# EAGLE design REV001 (EAGLE 7.7.0)
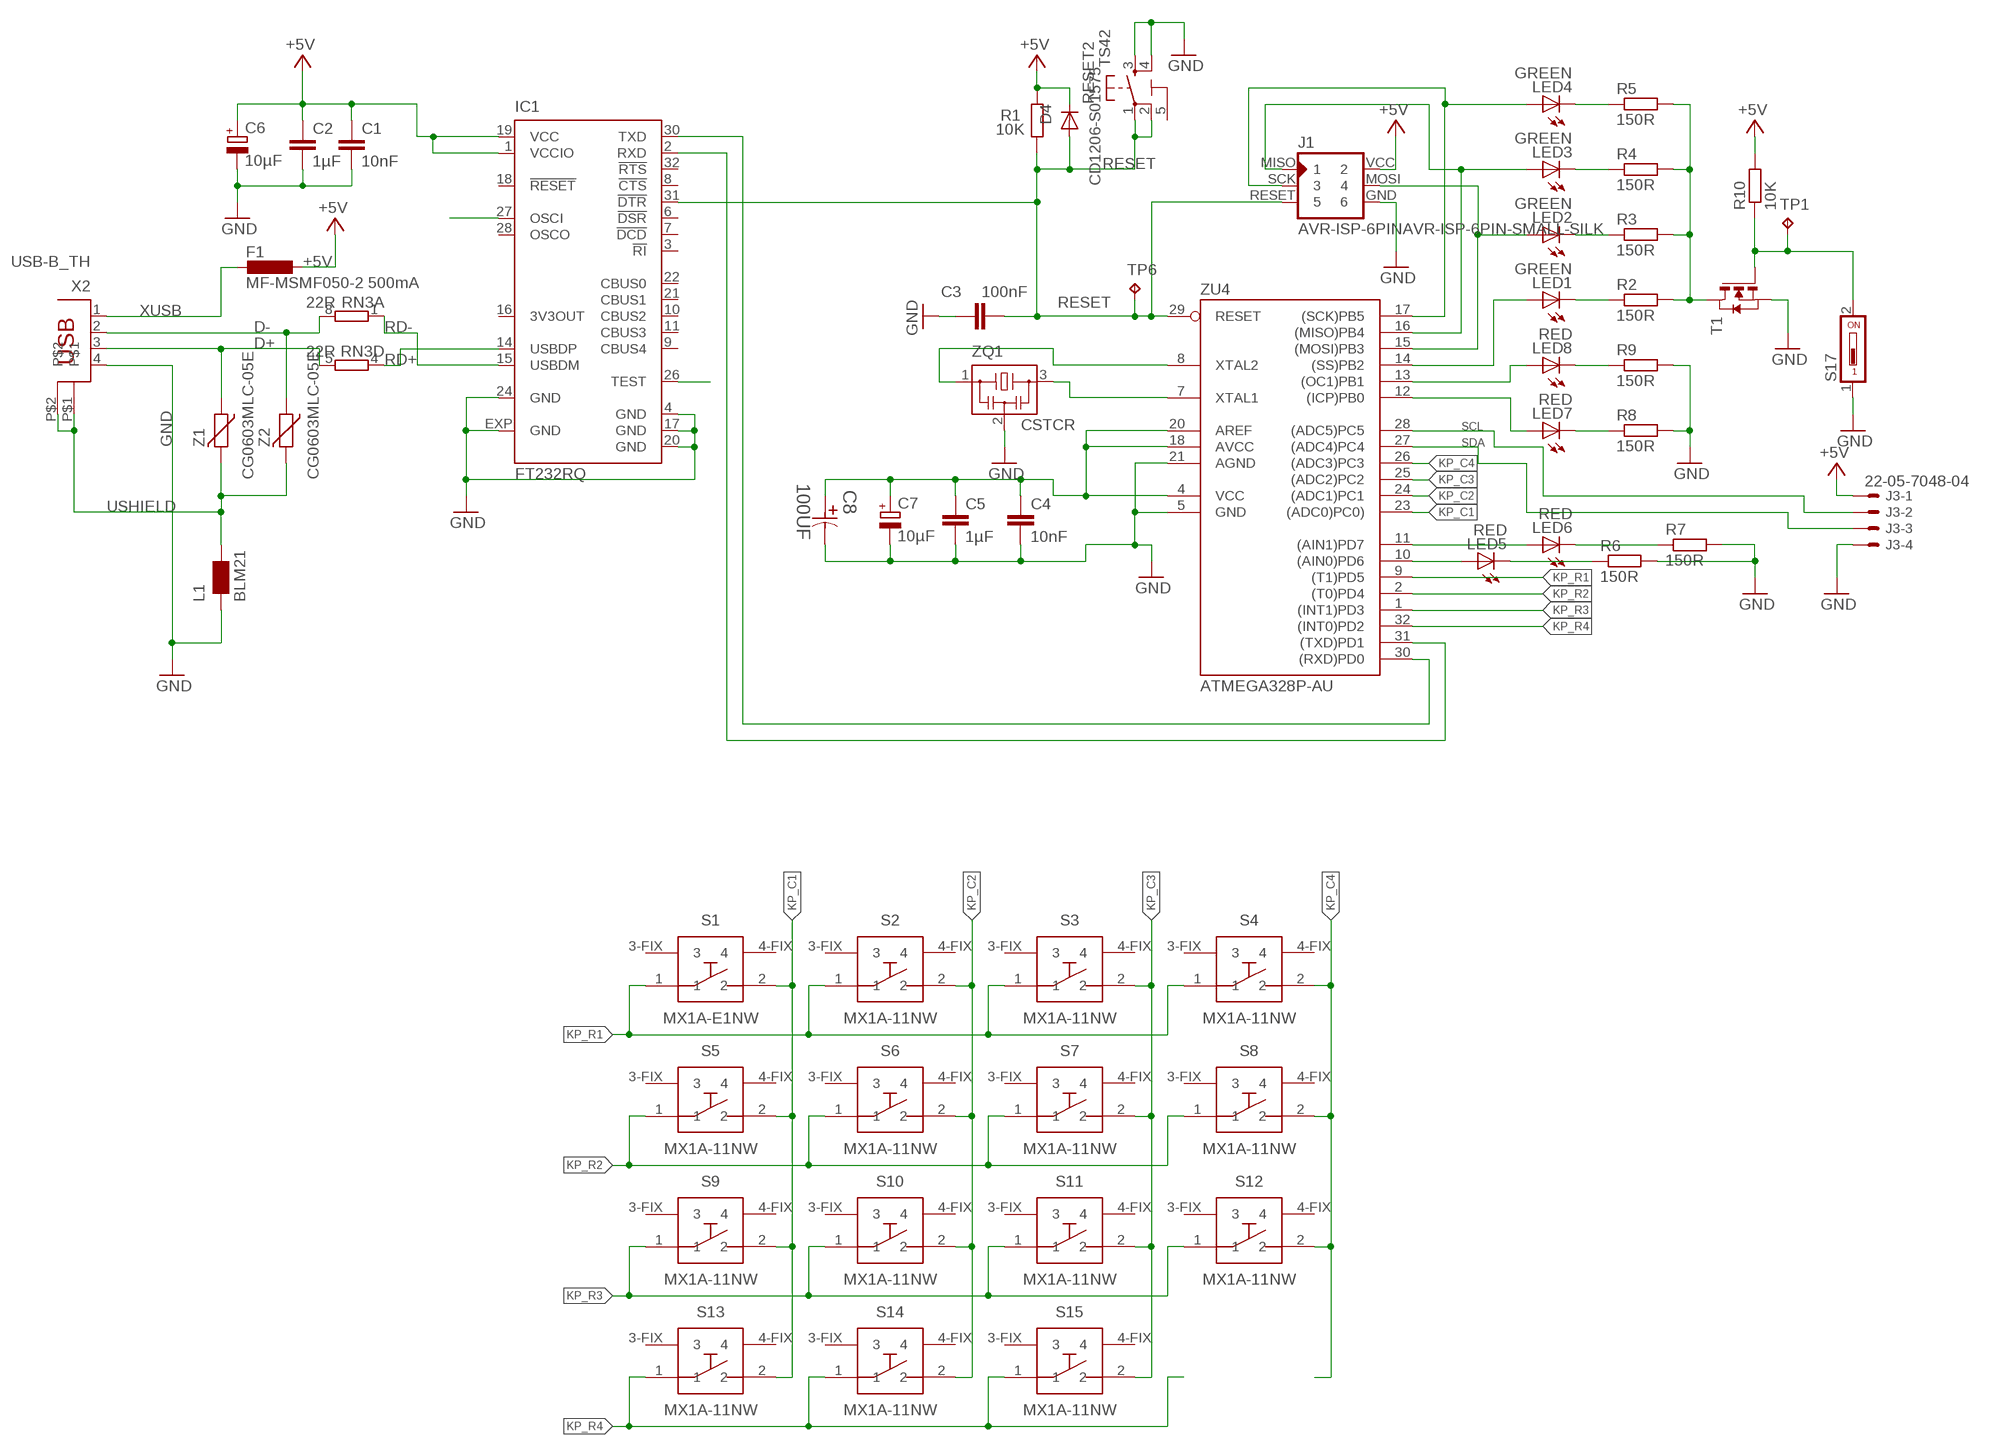
[diagram p0: schematic, sheet 1]

## Parts
C1  10nF  C-EUC0603K  [C0603K]
C2  1µF  C-EUC0603K  [C0603K]
C3  100nF  C-EUC0603  [C0603-ROUND]
C4  10nF  C-EUC0603K  [C0603K]
C5  1µF  C-EUC0603K  [C0603K]
C6  10µF  CPOL-EUSMCB  [SMC_B]
C7  10µF  CPOL-EUSMCB  [SMC_B]
C8  100UF  EEE-FT0J101AR-CASE-B  [CAPAE430X610N]
D4  CD1206-S01575  DIODE-MINIMELF  [MINIMELF]
F1  MF-MSMF050-2 500mA  L-EUL1812  [L1812]
IC1  FT232RQ  [QFN32]
J1  AVR-ISP-6PINAVR-ISP-6PIN-SMALL-SILK  [AVR-ISP-6PIN-SMAILL-SILK]
J3  22-05-7048-04  [7395-04]
L1  BLM21  WE-CBF_0805  [0805]
LED1  GREEN  LEDP-LCC-2  [P-LCC-2]
LED2  GREEN  LEDP-LCC-2  [P-LCC-2]
LED3  GREEN  LEDP-LCC-2  [P-LCC-2]
LED4  GREEN  LEDP-LCC-2  [P-LCC-2]
LED5  RED  LEDP-LCC-2  [P-LCC-2]
LED6  RED  LEDP-LCC-2  [P-LCC-2]
LED7  RED  LEDP-LCC-2  [P-LCC-2]
LED8  RED  LEDP-LCC-2  [P-LCC-2]
R1  10K  R-EU_R0805  [R0805]
R2  150R  R-EU_R0805  [R0805]
R3  150R  R-EU_R0805  [R0805]
R4  150R  R-EU_R0805  [R0805]
R5  150R  R-EU_R0805  [R0805]
R6  150R  R-EU_R0805  [R0805]
R7  150R  R-EU_R0805  [R0805]
R8  150R  R-EU_R0805  [R0805]
R9  150R  R-EU_R0805  [R0805]
R10  10K  R-EU_R0805  [R0805]
RESET2  TS42  [TS42]
RN3  22R  4R-NCAY16  [CAY16]
S1  MX1A-E1NW  MX1A-11NW  [MX1A-11NW_1]
S2  MX1A-11NW  [MX1A-11NW_1]
S3  MX1A-11NW  [MX1A-11NW_1]
S4  MX1A-11NW  [MX1A-11NW_1]
S5  MX1A-11NW  [MX1A-11NW_1]
S6  MX1A-11NW  [MX1A-11NW_1]
S7  MX1A-11NW  [MX1A-11NW_1]
S8  MX1A-11NW  [MX1A-11NW_1]
S9  MX1A-11NW  [MX1A-11NW_1]
S10  MX1A-11NW  [MX1A-11NW_1]
S11  MX1A-11NW  [MX1A-11NW_1]
S12  MX1A-11NW  [MX1A-11NW_1]
S13  MX1A-11NW  [MX1A-11NW_1]
S14  MX1A-11NW  [MX1A-11NW_1]
S15  MX1A-11NW  [MX1A-11NW_1]
S17  DS01  [DS-01]
T1  NMOSSOT23  [SOT-23]
TP1  TPB1,27  [B1,27]
TP6  TPB1,27  [B1,27]
X2  USB-B_TH  PN61729  [PN61729]
Z1  CG0603MLC-05E  VARISTORCN0603  [CT/CN0603]
Z2  CG0603MLC-05E  VARISTORCN0603  [CT/CN0603]
ZQ1  CSTCR  [CSTER12M]
ZU4  ATMEGA328P-AU  [TQFP32-08]

## Nets
+5V: C1.1 C2.1 C4.1 C5.1 C6.+ C7.+ C8.1 D4.C F1.1 IC1.1(VCCIO) IC1.19(VCC) J1.VCC J3.1 R1.2 R10.2 ZU4.4(VCC) ZU4.18(AVCC) ZU4.20(AREF)
D+: RN3.5 X2.3 Z1.1
D-: RN3.8 X2.2 Z2.1
GND: C1.2 C2.2 C3.2 C4.2 C5.2 C6.- C7.- C8.2 IC1.4(GND) IC1.17(GND) IC1.20(GND) IC1.24(GND) IC1.EXP(GND) J1.GND J3.4 L1.1 R6.2 R7.2 R8.2 R9.2 RESET2.3 RESET2.4 S17.1 T1.2(S) X2.4 ZQ1.2 ZU4.5(GND) ZU4.21(AGND)
ISP_ENABLE: R10.1 S17.2 T1.3(G) TP1.TP
KP_C1: S1.2 S5.2 S9.2 S13.2 ZU4.23((ADC0)PC0))
KP_C2: S2.2 S6.2 S10.2 S14.2 ZU4.24((ADC1)PC1)
KP_C3: S3.2 S7.2 S11.2 S15.2 ZU4.25((ADC2)PC2)
KP_C4: S4.2 S8.2 S12.2 ZU4.26((ADC3)PC3)
KP_R1: S1.1 S2.1 S3.1 S4.1 ZU4.9((T1)PD5)
KP_R2: S5.1 S6.1 S7.1 S8.1 ZU4.2((T0)PD4)
KP_R3: S9.1 S10.1 S11.1 S12.1 ZU4.1((INT1)PD3)
KP_R4: S13.1 S14.1 S15.1 ZU4.32((INT0)PD2)
LED1+: LED1.A ZU4.14((SS)PB2)
LED1-: LED1.C R2.1
LED2+: J1.MOSI LED2.A ZU4.15((MOSI)PB3)
LED2-: LED2.C R3.1
LED3+: J1.MISO LED3.A ZU4.16((MISO)PB4)
LED3-: LED3.C R4.1
LED4+: J1.SCK LED4.A ZU4.17((SCK)PB5)
LED4-: LED4.C R5.1
LED5+: LED5.A ZU4.10((AIN0)PD6)
LED5-: LED5.C R6.1
LED6+: LED6.A ZU4.11((AIN1)PD7)
LED6-: LED6.C R7.1
LED7+: LED7.A ZU4.12((ICP)PB0)
LED7-: LED7.C R8.1
LED8+: LED8.A ZU4.13((OC1)PB1)
LED8-: LED8.C R9.1
N$2: IC1.26(TEST)
N$3: IC1.27(OSCI)
N$20 [gnd]: R2.2 R3.2 R4.2 R5.2 T1.1(D)
RD+: IC1.14(USBDP) RN3.4
RD-: IC1.15(USBDM) RN3.1
RESET: C3.1 D4.A IC1.31(!DTR) J1.RESET R1.1 RESET2.1 RESET2.2 TP6.TP ZU4.29(RESET)
RX: IC1.2(RXD) ZU4.31((TXD)PD1)
SCL: J3.2 ZU4.28((ADC5)PC5)
SDA: J3.3 ZU4.27((ADC4)PC4)
TX: IC1.30(TXD) ZU4.30((RXD)PD0)
USHIELD [gnd]: L1.2 X2.P$1 X2.P$2 Z1.2 Z2.2
XTAL1: ZQ1.3 ZU4.7(XTAL1)
XTAL2: ZQ1.1 ZU4.8(XTAL2)
XUSB [usbvcc]: F1.2 X2.1
Unconnected: IC1.3(!RI) IC1.6(!DSR) IC1.7(!DCD) IC1.8(!CTS) IC1.9(CBUS4) IC1.10(CBUS2) IC1.11(CBUS3) IC1.16(3V3OUT) IC1.18(!RESET) IC1.21(CBUS1) IC1.22(CBUS0) IC1.28(OSCO) IC1.32(!RTS) RN3.2 RN3.3 RN3.6 RN3.7 S1.3-FIX S1.4-FIX S2.3-FIX S2.4-FIX S3.3-FIX S3.4-FIX S4.3-FIX S4.4-FIX S5.3-FIX S5.4-FIX S6.3-FIX S6.4-FIX S7.3-FIX S7.4-FIX S8.3-FIX S8.4-FIX S9.3-FIX S9.4-FIX S10.3-FIX S10.4-FIX S11.3-FIX S11.4-FIX S12.3-FIX S12.4-FIX S13.3-FIX S13.4-FIX S14.3-FIX S14.4-FIX S15.3-FIX S15.4-FIX

## Power pins joined to a net without a drawn wire
5-GND: RESET2.5(5-GND)

## Library data of the parts
C1 C2 C4 C5 = rcl:C-EU: CAPACITOR, European symbol
C3 = SmartPrj:C-EU: CAPACITOR, European symbol
C6 C7 = rcl:CPOL-EU: POLARIZED CAPACITOR, European symbol
C8 = Panasonic-EEEFT_EEEH:EEE-: Aluminum Electrolytic Capacitors,Surface Mount Type; MPN: EEE-FT0J101AR; OC_FARNELL: 2065951; OC_NEWARK: 73T9146; PACKAGE: CASE-B; SUPPLIER: PANASONIC; TOLERANCE: ±20 %; VOLTAGERATING: 6.3V
D4 = diode:DIODE-: DIODE
F1 = rcl:L-EU: INDUCTOR, European symbol
IC1 = ftdichip:FT232R: Source: http://www.ftdichip.com/Documents/DataSheets/DS_FT232R_v104.pdf; MPN: FT232RQ; OC_FARNELL: 1146033; OC_NEWARK: 91K9919
J1 = avr-isb:AVR-ISP-6PIN: AVR ISP 6pin 3x2 pin header
J3 = con-molex:22-?-04: CONNECTOR wire to board 2.54 mm (.1 inch) pitch header; OC_FARNELL: unknown; OC_NEWARK: unknown
L1 = wuerth-elektronik:WE-CBF: SMD EMI Suppression Ferrite Beads - excellent anti-EMI properties - low DCR - impedances till 3000 ohms - rated current up to 6 A
LED1-LED8 = adafruit:LED: LED OSRAM: - CHIPLED LG R971, LG N971, LY N971, LG Q971, LY Q971, LO R971, LY R971 LH N974, LH R974 LS Q976, LO Q976, LY Q976 LO Q996 - Hyper CHIPLED LW Q18S LB Q993, LB Q99A, LB R99A - SideLED LS A670, LO A670, LY A670, LG A670, LP A670 LB A673, LV A673, LT A673, LW A673 LH A674 LY A675 LS A676, LA A676, LO A676, LY A676, LW A676 LS A679, LY A679, LG A679 - Hyper Micro SIDELED® LS Y876, LA Y876, LO Y876, LY Y876 LT Y87S - SmartLED LW L88C, LW L88S LB L89C, LB L89S, LG L890 LS L89K, LO L89K, LY L89K LS L896, LA L896, LO L896, LY L896 - TOPLED LS T670, LO T670, LY T670, LG T670, LP T670 LSG T670, LSP T670, LSY T670, LOP T670, LYG T670 LG T671, LOG T671, LSG T671 LB T673, LV T673, LT T673, LW T673 LH T674 LS T676, LA T676, LO T676, LY T676, LB T676, LH T676, LSB T676, LW T676 LB T67C, LV T67C, LT T67C, LS T67K, LO T67K, LY T67K, LW E67C LS E67B, LA E67B, LO E67B, LY E67B, LB E67C, LV E67C, LT E67C LW T67C LS T679, LY T679, LG T679 LS T770, LO T770, LY T770, LG T770, LP T770 LB T773, LV T773, LT T773, LW T773 LH T774 LS E675, LA E675, LY E675, LS T675 LS T776, LA T776, LO T776, LY T776, LB T776 LHGB T686 LT T68C, LB T68C - Hyper Mini TOPLED® LB M676 - Mini TOPLED Santana® LG M470 LS M47K, LO M47K, LY M47K Source: http://www.osram.convergy.de/
R1 = SmartPrj:R-EU_: RESISTOR, European symbol
R2-R10 = rcl:R-EU_: RESISTOR, European symbol
RESET2 = SmartPrj:TS42: TS42 Dongnan Electronics Tact switch VDC 12V - 50mA
RN3 = resistor-dil:4R-N: Array Chip Resistor Source: RS Component / Phycomp; OC_FARNELL: unknown; OC_NEWARK: unknown
S1-S15 = SamacSys_Parts:MX1A-11NW: CHERRY AMERICAS - MX1A-11NW - SWITCH, TACTILE, SPST-NO, 0.01A, THT <https://componentsearchengine.com/Images/1/MX1A-11NW.jpg> Source: Datasheet <http://media.digikey.com/pdf/Data Sheets/Cherry PDFs/MX Series.pdf>; DESCRIPTION: CHERRY AMERICAS - MX1A-11NW - SWITCH, TACTILE, SPST-NO, 0.01A, THT; HEIGHT: mm; MANUFACTURER_NAME: CHERRY AMERICAS; MANUFACTURER_PART_NUMBER: MX1A-11NW
S17 = switch-dil:DS01: DIL/CODE SWITCH; OC_FARNELL: unknown; OC_NEWARK: unknown
T1 = zetex:NMOSSOT23: MOS FET; OC_FARNELL: unknown; OC_NEWARK: unknown
TP1 TP6 = testpad:TP: Test pad
X2 = SmartPrj:PN61729: BERG USB connector
Z1 Z2 = varistor:VARISTOR: VARISTOR
ZQ1 = murata_reso:CSTC?: Resonator CSTCR �- 2.0 x 4.5 mm <http://search.murata.co.jp/Ceramy/CatalogAction.do?sHinnm=?&nbsp&sNHinnm=CSTCR6M00G53-R0&sNhin_key=CSTCR6M00G53-R0&sLang=en&sParam=CSTCR> CSTCE �- 1.3 x 3.2 mm <http://search.murata.co.jp/Ceramy/CatalogAction.do?sHinnm=?&nbsp&sNHinnm=CSTCE8M00G52-R0&sNhin_key=CSTCE8M00G52-R0&sLang=en&sParam=CSTCE>
ZU4 = SmartPrj:ATMEGA328P-: MICROCONTROLLER 4 Kbytes FLASH 128 bytes SRAM 256 bytes EEPROM UART 6-channel 10 bit ADC

## Net classes
1 power: width 0.152 mm, drill 0.61 mm, clearance 0.152 mm
2 gnd: width 0.305 mm, drill 0.559 mm, clearance 0.254 mm
3 usbvcc: width 0.508 mm, drill 0.61 mm, clearance 0.254 mm
4 aref: width 0.406 mm, drill 0.61 mm, clearance 0.254 mm

## Board
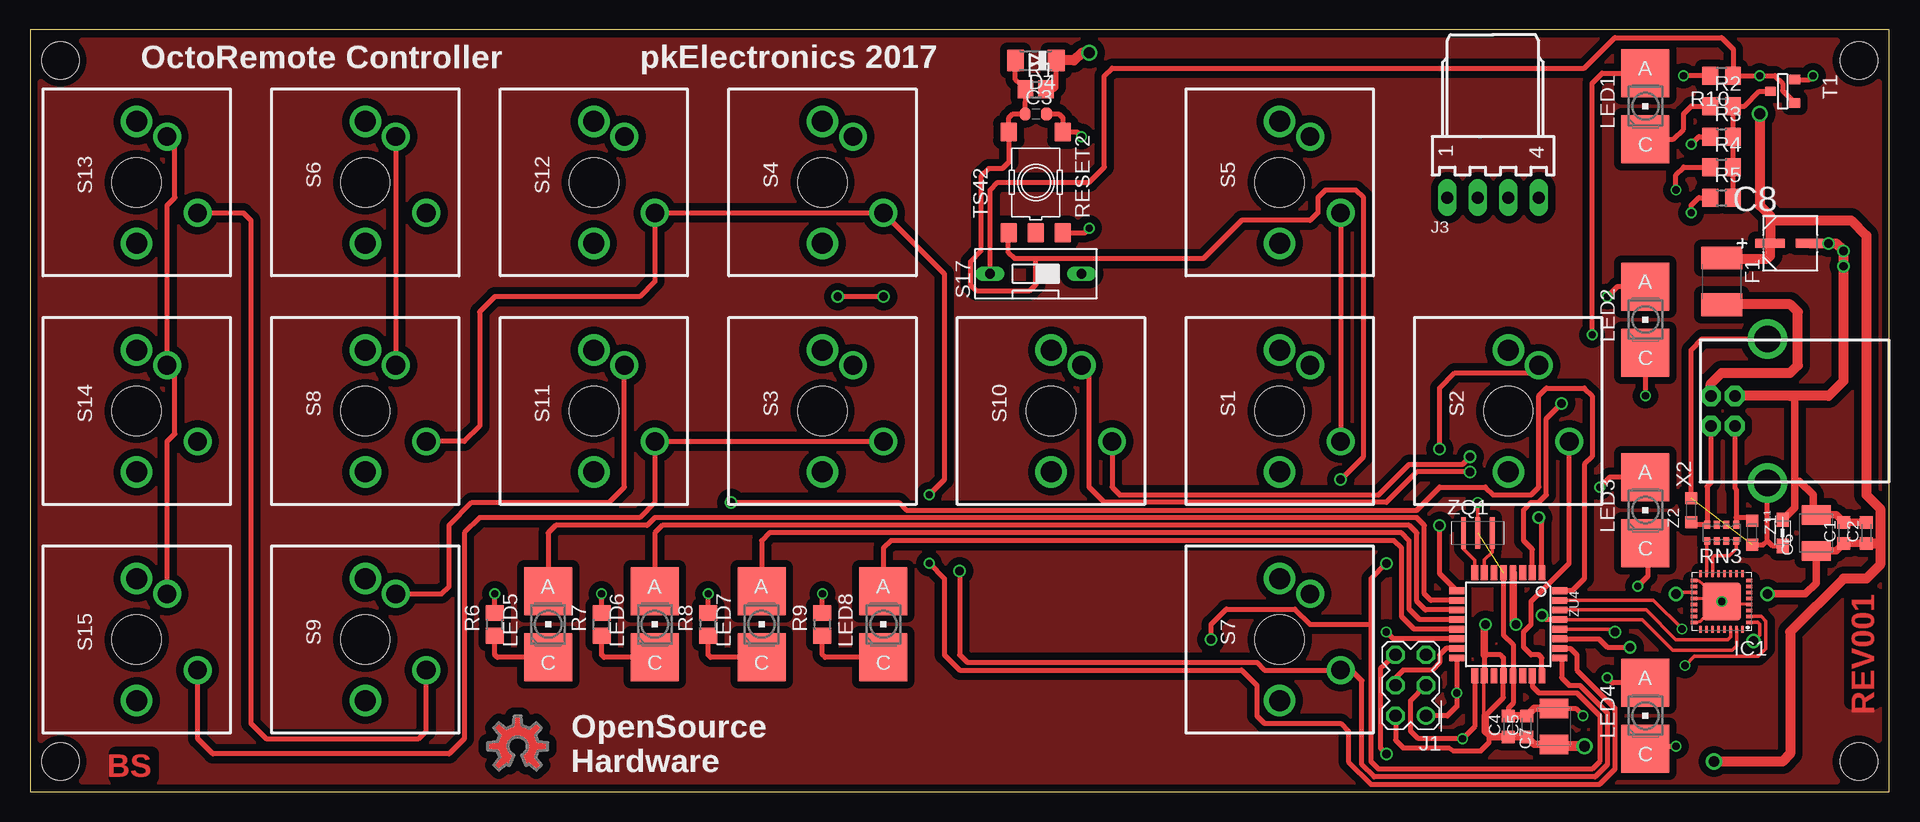
[diagram p1: board, top side]
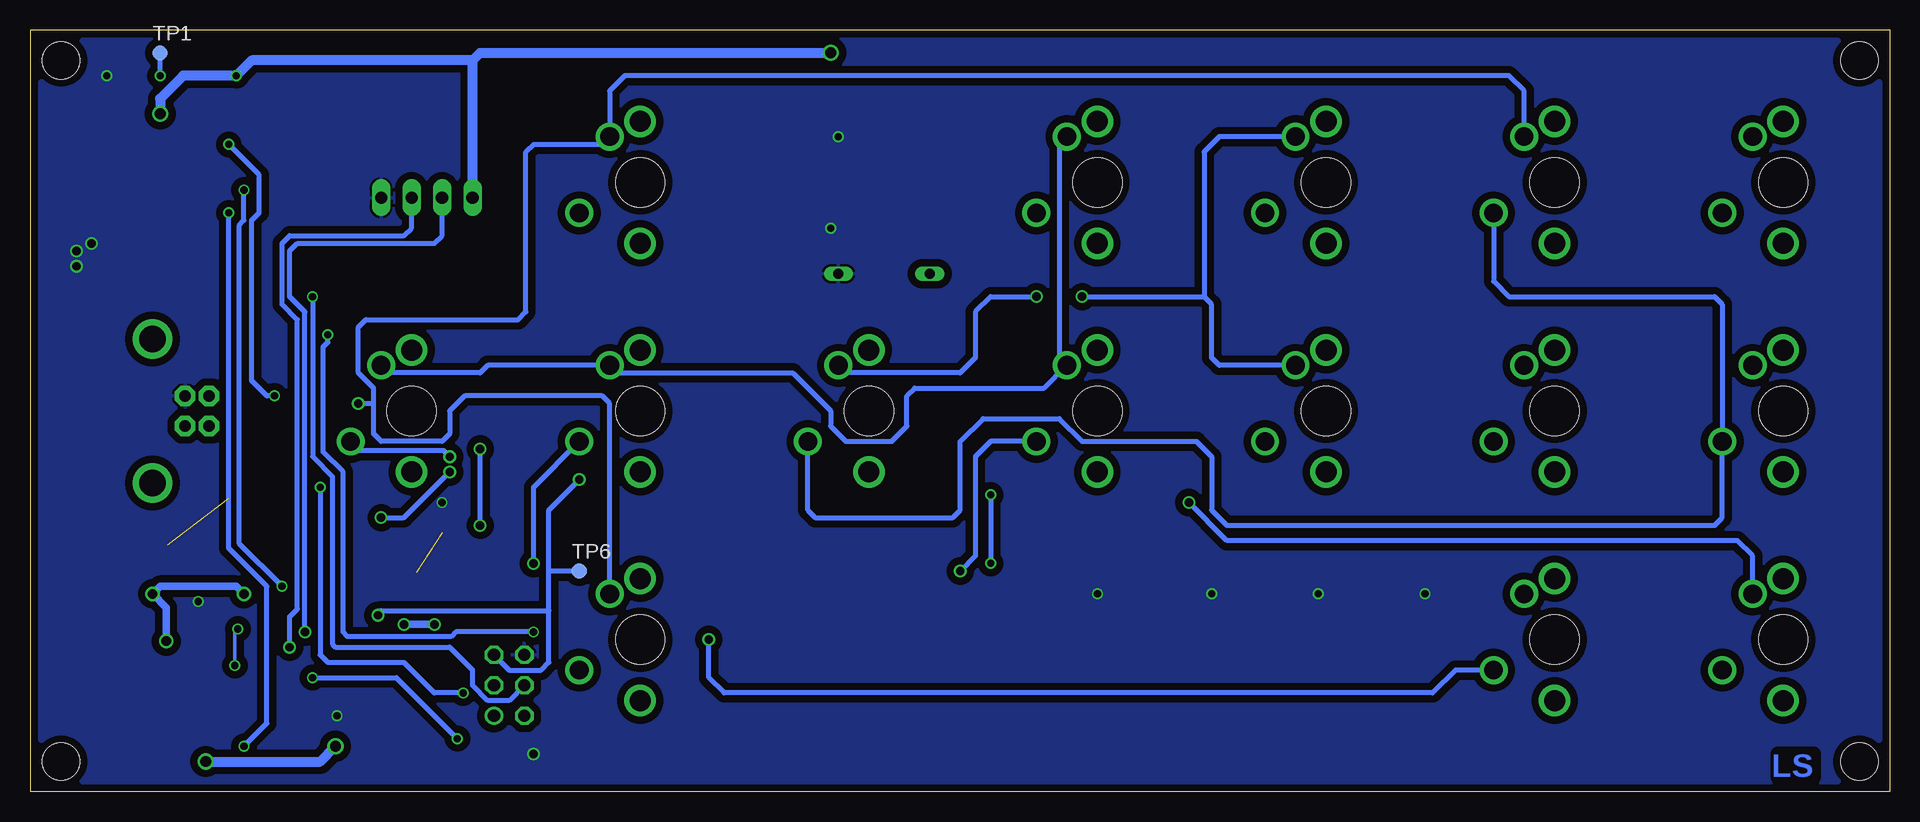
[diagram p2: board, bottom side, seen from below]

Size 154.94 x 63.5 mm. Coordinates in mm from the lower left corner, seen from the top.
Outline: 0,0 154.94,0 154.94,63.5 0,63.5 0,0
Copper layers (1*16): Top 0.018mm / dielectric 1.55mm / Bottom 0.018mm
Design rules "eC_2Layer_PClass6_BaseCopperO18_eCDefault": minimum track width 0.15mm, minimum drill 0.35mm, track to track 0.15mm, track to pad 0.15mm, pad to pad 0.15mm, via to via 0.15mm, smd to smd 0mil, copper to edge 0.25mm, drill to drill 0.35mm, minimum pad ring 0.175mm, minimum via ring 0.125mm, stop-mask expansion 0mil, vias tented up to drill 0.45mm, thermal gap 0.2mm
Holes 3.1 mm at 2.54,2.54 2.54,60.96 152.4,2.54 152.4,60.96

### Footprints (pad centres in the part's own frame; a part is rotated, then mirrored left to right if it is on the bottom)
C0603K = smd 1.05 x 1.08: 1 -0.875,0; 2 0.875,0
C0603-ROUND = smd 0.898 x 1.1: 1 -0.889,0; 2 0.889,0
SMC_B = smd 1.6 x 2.4: + -1.5,0; - 1.5,0
CAPAE430X610N = smd 2.464 x 0.762: 1 -1.676,0; 2 1.676,0
MINIMELF = smd 1.4 x 1.8: A 1.7,0; C -1.7,0
L1812 = smd 1.9 x 3.4: 1 -1.95,0; 2 1.95,0
QFN32 = smd 0.6 x 0.3: 1 -2.3,1.75; 2 -2.3,1.25; 3 -2.3,0.75; 4 -2.3,0.25; 5 -2.3,-0.25; 6 -2.3,-0.75; 7 -2.3,-1.25; 8 -2.3,-1.75; 17 2.3,-1.75; 18 2.3,-1.25; 19 2.3,-0.75; 20 2.3,-0.25; 21 2.3,0.25; 22 2.3,0.75; 23 2.3,1.25; 24 2.3,1.75 | smd 0.3 x 0.6: 9 -1.75,-2.3; 10 -1.25,-2.3; 11 -0.75,-2.3; 12 -0.25,-2.3; 13 0.25,-2.3; 14 0.75,-2.3; 15 1.25,-2.3; 16 1.75,-2.3; 25 1.75,2.3; 26 1.25,2.3; 27 0.75,2.3; 28 0.25,2.3; 29 -0.25,2.3; 30 -0.75,2.3; 31 -1.25,2.3; 32 -1.75,2.3 | smd 3.2 x 3.2: EXP 0,0
AVR-ISP-6PIN-SMAILL-SILK = drill 1.016 octagon: GND 1.27,-2.54; MOSI 1.27,0; RESET -1.27,-2.54; SCK -1.27,0; VCC 1.27,2.54 | drill 1.016: MISO -1.27,2.54
7395-04 = drill 1.016 long: 1 3.81,0; 2 1.27,0; 3 -1.27,0; 4 -3.81,0
0805 = smd 1.2 x 1: 1 -1.1,0; 2 1.1,0
P-LCC-2 = smd 4 x 4: A 0,2.75; C 0,-2.75
R0805 = smd 1.3 x 1.5: 1 -0.85,0; 2 0.85,0
R0805' = smd 1.3 x 1.5: 1 -0.95,0; 2 0.95,0
TS42 = smd 1.6 x 1.4: 1 -4.2,2.25; 2 4.2,2.25; 3 -4.2,-2.25; 4 4.2,-2.25; 5 -4.2,0
CAY16 = smd 0.5 x 0.65: 1 -1.2,-0.675; 2 -0.4,-0.675; 3 0.4,-0.675; 4 1.2,-0.675; 5 1.2,0.675; 6 0.4,0.675; 7 -0.4,0.675; 8 -1.2,0.675
MX1A-11NW_1 = drill 1.55: 1 -3.81,2.54; 2 2.54,5.08 | drill 1.75: 3-FIX -5.08,0; 4-FIX 5.08,0 | hole 4.1: 0,0
DS-01 = drill 0.813 long: 1 0,-3.81; 2 0,3.81
SOT-23 = smd 0.787 x 0.889: 1 0.025,-1.016; 2 -0.94,1.016; 3 0.991,1.016
B1,27 = smd 1.27 x 1.27: TP 0,0
PN61729 = drill 0.95 pad 1.676 octagon: 1 1.25,4.71; 2 -1.25,4.71; 3 -1.25,2.71; 4 1.25,2.71 | drill 2.2: P$1 -6,0; P$2 6,0
CT/CN0603 = smd 1 x 1: 1 -1,0; 2 1,0
CSTER12M = smd 0.4 x 2.6: 1 -1.2,0; 2 0,0; 3 1.2,0
TQFP32-08 = smd 1.27 x 0.559: 1 -4.293,2.8; 2 -4.293,2; 3 -4.293,1.2; 4 -4.293,0.4; 5 -4.293,-0.4; 6 -4.293,-1.2; 7 -4.293,-2; 8 -4.293,-2.8; 17 4.293,-2.8; 18 4.293,-2; 19 4.293,-1.2; 20 4.293,-0.4; 21 4.293,0.4; 22 4.293,1.2; 23 4.293,2; 24 4.293,2.8 | smd 0.559 x 1.27: 9 -2.8,-4.293; 10 -2,-4.293; 11 -1.2,-4.293; 12 -0.4,-4.293; 13 0.4,-4.293; 14 1.2,-4.293; 15 2,-4.293; 16 2.8,-4.293; 25 2.8,4.293; 26 2,4.293; 27 1.2,4.293; 28 0.4,4.293; 29 -0.4,4.293; 30 -1.2,4.293; 31 -2,4.293; 32 -2.8,4.293

### Placement (x,y rotation side)
C1  151.13,21.59 90 top
C2  153.03,21.59 90 top
C3  83.82,56.52 0 top
C4  123.19,5.46 90 top
C5  124.71,5.46 90 top
C6  148.84,21.59 90 top
C7  127,5.46 90 top
C8  146.69,45.72 0 top
D4  83.82,60.96 180 top
F1  140.97,42.55 270 top
IC1  140.97,15.88 180 top
J1  115.06,8.89 180 top
J3  121.92,49.53 180 top
L1  146.05,21.59 270 top
LED1  134.62,57.15 0 top
LED2  134.62,39.37 0 top
LED3  134.62,23.5 0 top
LED4  134.62,6.35 0 top
LED5  43.18,13.97 0 top
LED6  52.07,13.97 0 top
LED7  60.96,13.97 0 top
LED8  71.12,13.97 0 top
R1  83.82,58.55 0 top
R2  150R  [R0805']  140.97,57.15 0 top
R3  150R  [R0805']  140.97,54.61 0 top
R4  150R  [R0805']  140.97,52.07 0 top
R5  150R  [R0805']  140.97,49.53 0 top
R6  150R  [R0805']  38.73,13.97 90 top
R7  150R  [R0805']  47.62,13.97 90 top
R8  150R  [R0805']  56.52,13.97 90 top
R9  150R  [R0805']  66.04,13.97 90 top
R10  10K  [R0805']  140.97,59.69 180 top
RESET2  83.82,50.8 90 top
RN3  140.97,21.59 0 top
S1  104.14,31.75 270 top
S2  123.19,31.75 270 top
S3  66.04,31.75 270 top
S4  66.04,50.8 270 top
S5  104.14,50.8 270 top
S6  27.94,50.8 270 top
S7  104.14,12.7 270 top
S8  27.94,31.75 270 top
S9  27.94,12.7 270 top
S10  85.09,31.75 270 top
S11  46.99,31.75 270 top
S12  46.99,50.8 270 top
S13  8.89,50.8 270 top
S14  8.89,31.75 270 top
S15  8.89,12.7 270 top
S17  83.82,43.18 90 top
T1  146.05,58.42 270 top
TP1  144.15,61.6 0 bottom
TP6  109.22,18.41 0 bottom
U$1  [OSHWLOGO_TOP_0.2]  40.64,3.81 0 top
X2  144.78,31.75 90 top
Z1  143.51,21.59 270 top
Z2  138.43,23.5 90 top
ZQ1  120.65,21.59 0 top
ZU4  123.19,13.97 270 top

### Tracks (layer width: path | path; a pad name or v marks a point on that pad's centre or on a via)
+5V  (via drill 0.6 pad 0.3, 0.7, 0.8, 0.9 pad 0.3)
  Top 0.305: IC1.1 143.99,14.12 144.15,13.97 144.15,13.08 v143.64,12.57 | v137.16,16.51 137.28,16.62 IC1.19 | 121.28,6.35 121.16,6.48 | 121.16,9.78 121.16,5.71 121.28,5.71
  Top 0.406: R1.2 85.34,58.55 85.52,58.72 D4.C | J1.VCC 113.79,4.32 114.43,3.68 118.24,3.68 118.62,3.43 120.9,3.43 121.6,4.13 121.6,4.76 | R10.2 v137.79,59.69 | 121.28,6.35 122.79,7.86 ZU4.20 122.79,11.2 122.56,11.43 121.28,11.43 121.19,11.33 ZU4.18 | 121.19,5.08 121.28,5.08
  Top 0.61: ZU4.4 123.59,14.21 v123.83,13.97 | v121.28,13.97 121.19,13.88 121.19,11.43 121.28,11.43 | v144.78,16.51 147.96,16.51 148.84,17.4 C6.+ 150.5,20.09 C1.1 C2.1 | C7.+ 125.34,3.96 C5.1 C4.1 121.78,4.59 121.6,4.76 121.28,5.08 121.28,5.71 121.28,6.35
  Top 0.813: F1.1 141.01,44.45 144.78,44.45 145.01,44.68 C8.1 145.01,48.03 | v88.27,61.6 87.63,61.6 87,60.96 D4.C | v144.15,56.52 144.15,48.9 145.01,48.03 | 145.01,48.03 arc90 145.41,47.62 151.76,47.62 153.03,46.36 153.03,24.77 154.18,23.62 154.18,20.95 | 154.18,20.95 154.18,18.92 153.03,17.78 151.13,17.78 146.69,13.33 146.69,3.17 146.05,2.54 v140.34,2.54 | v129.54,3.81 127.15,3.81 C7.+ | C2.1 154.06,20.71 154.18,20.95
  Bottom 0.61: v123.83,13.97 v121.28,13.97 | v137.16,16.51 137.79,17.14 144.15,17.14 v144.78,16.51 143.64,15.37 v143.64,12.57
  Bottom 0.813: J3.1 118.11,60.96 | 118.11,60.96 117.47,61.6 v88.27,61.6 | 118.11,60.96 136.53,60.96 v137.79,59.69 142.24,59.69 144.15,57.79 v144.15,56.52 | v140.34,2.54 130.81,2.54 v129.54,3.81
D+
  Top 0.406: X2.3 142.07,25.32 142.17,25.22 142.17,22.86 | 142.17,22.86 RN3.5 | Z1.1 143.24,22.86 142.17,22.86
D-
  Top 0.406: X2.2 140.07,25.77 139.77,25.47 RN3.8 138.66,22.27 Z2.1
GND  (via drill 0.6, 0.6 pad 0.3, 0.7 pad 0.3)  (1 unrouted)
  Top 0.254: IC1.20 140.09,16.12 | IC1.4 141.99,15.62 141.6,15.24 IC1.EXP | IC1.17 138.97,17.62 139.32,17.4 139.57,17.14 139.7,17.14 IC1.EXP | 139.7,14.86 139.95,14.86 140.14,15.05 | 140.14,15.05 IC1.EXP | IC1.24 138.97,14.12 139.06,14.22 139.19,14.22 139.32,14.35 140.14,15.05
  Top 0.305: ZQ1.2 v120.65,24.13 | 140.09,16.12 140.34,15.88 | 140.34,15.88 IC1.EXP | 140.34,15.24 140.34,15.88
  Top 0.406: C4.2 123.19,6.98 123.59,7.38 ZU4.21 123.59,12.3 122.79,13.1 ZU4.5 | T1.2 148.26,59.36 v148.59,59.69 | C7.- 128.8,6.96 v129.41,6.35 129.54,6.22 | C3.2 85.72,56.52 86.07,56.17 RESET2.4 87.24,55 v87.63,54.61 | RESET2.3 87.88,46.6 v88.27,46.99 | R9.2 v66.04,16.51 | R8.2 v56.52,16.51 | R7.2 v47.62,16.51 | R6.2 v38.73,16.51 | J1.GND 112.52,10.29 112.52,3.68 v113.03,3.17
  Top 0.61: C2.2 C1.2 150.5,23.09 C6.- 148.59,23.34 148.59,24.77 147.45,25.91 147.07,25.91 | L1.1 147.07,23.71 147.07,25.91 | X2.4 142.09,33.02 145.41,33.02 | 147.07,25.91 147.07,33 146.69,33 | C4.2 C5.2 125.34,6.96 C7.-
  Top 0.813: C8.2 v149.86,45.72 150.5,45.72 v151.13,45.09 v151.13,43.82 151.13,34.25 149.88,33 146.69,33 X2.4
  other vias: 140.97,15.88
  pour Bottom (isolate 0.61): 4.45,62.87 0.64,59.05 0.64,4.45 4.45,0.64 150.5,0.64 154.31,4.45 154.31,59.05 150.5,62.87
ISP_ENABLE  (via drill 0.6 pad 0.3)
  Top 0.406: T1.3 146.05,58.45 146.05,59.05 145.41,59.69 v144.15,59.69 R10.1 141.92,61.92 140.97,62.87 132.08,62.87 129.54,60.33 90.17,60.33 89.53,59.69 89.53,52.07 88.27,50.8 80.64,50.8 80.01,50.17 S17.2
  Bottom 0.406: v144.15,59.69 TP1.TP
KP_C1  (via drill 0.7 pad 0.3)
  Top 0.406: ZU4.23 125.19,8.79 125.73,8.26 128.91,8.26 130.81,6.35 130.81,2.54 130.18,1.91 112.39,1.91 111.76,2.54 111.76,13.97 | S13.2 17.78,48.26 18.41,47.62 18.41,5.71 19.68,4.45 32.38,4.45 33.02,5.08 S9.2 | S5.2 S1.2 | 111.76,13.97 111.76,17.78 v113.03,19.05 | v98.42,12.7 98.42,13.97 99.69,15.24 105.41,15.24 106.68,13.97 111.76,13.97
  Bottom 0.406: v113.03,19.05 113.03,25.4 S1.2 | S9.2 36.2,10.16 38.1,8.26 97.16,8.26 98.42,9.53 v98.42,12.7
KP_C2  (via drill 0.7 pad 0.3)
  Top 0.406: S2.2 128.27,19.05 125.09,15.88 125.09,13.97 124.46,13.33 124.46,12.06 125.09,11.43 125.73,11.43 125.99,11.17 ZU4.24 | S10.2 90.17,25.4 90.81,24.77 112.39,24.77 114.94,27.3 119.38,27.3 v120.02,27.94
  Bottom 0.406: S6.2 33.02,42.55 31.75,41.28 14.61,41.28 13.97,40.64 S14.2 13.97,22.86 14.61,22.22 55.24,22.22 56.52,23.5 56.52,27.94 57.78,29.21 67.31,29.21 69.22,31.11 75.56,31.11 77.47,29.21 77.47,23.5 78.11,22.86 89.53,22.86 90.17,23.5 S10.2 | v120.02,27.94 120.52,28.45 127.51,28.45 S2.2
KP_C3  (via drill 0.7 pad 0.3)
  Top 0.406: ZU4.25 127.64,11.02 127.64,9.53 128.27,8.89 129.16,8.89 131.44,6.6 131.44,2.29 130.43,1.27 112.01,1.27 111,2.29 111,9.27 110.11,10.16 S7.2 102.87,10.16 102.23,10.79 78.11,10.79 77.47,11.43 v77.47,18.41 | S3.2 S11.2 52.07,24.13 50.8,22.86 37.47,22.86 36.2,21.59 36.2,4.45 34.92,3.17 15.24,3.17 13.97,4.45 S15.2
  Bottom 0.406: S3.2 74.93,29.21 76.2,27.94 76.2,19.68 v77.47,18.41
KP_C4  (via drill 0.6 pad 0.3)
  Top 0.406: ZU4.26 128.37,11.97 128.91,11.43 128.91,10.16 132.08,6.98 132.08,1.91 130.81,0.64 111.76,0.64 109.86,2.54 109.86,5.08 109.22,5.71 102.87,5.71 102.23,6.35 102.23,8.89 100.97,10.16 77.47,10.16 76.2,11.43 76.2,17.78 v74.93,19.05 | S8.2 36.2,29.21 37.47,30.48 37.47,40.01 38.73,41.28 50.8,41.28 52.07,42.55 S12.2 S4.2 76.2,43.18 76.2,26.04 v74.93,24.77
  Bottom 0.406: v74.93,24.77 v74.93,19.05
KP_R1  (via drill 0.7 pad 0.3)
  Top 0.406: ZU4.9 117.47,18.19 v117.47,22.22 | S2.1 125.09,34.93 118.75,34.93 117.47,33.66 v117.47,28.57
  Bottom 0.406: S4.1 69.22,53.98 69.22,36.2 S3.1 70.48,33.66 81.28,33.66 81.92,33.02 81.92,30.48 83.19,29.21 87,29.21 88.27,30.48 88.27,31.75 91.44,34.93 106.05,34.93 S1.1 116.84,35.56 117.47,34.93 125.09,34.93 S2.1 | v117.47,22.22 v117.47,28.57
KP_R2  (via drill 0.7 pad 0.3)
  Top 0.406: S6.1 S8.1 | ZU4.2 125.19,20.22 124.46,20.95 124.46,23.5 125.09,24.13 125.73,24.13 126.36,24.77 126.36,31.11 v127.64,32.38
  Bottom 0.406: S6.1 30.48,58.42 31.75,59.69 105.41,59.69 106.68,58.42 S5.1 107.31,53.98 113.03,53.98 113.67,53.34 113.67,40.01 114.3,39.37 127,39.37 127.64,38.74 127.64,34.93 126.36,33.66 126.36,32.38 | S7.1 106.68,32.38 107.31,33.02 118.75,33.02 120.02,31.75 120.02,29.84 120.65,29.21 125.73,29.21 126.36,29.84 126.36,32.38 | v127.64,32.38 126.36,32.38
KP_R3  (via drill 0.7 pad 0.3, 0.7 pad 0.61)
  Top 0.406: S9.1 34.29,16.51 34.92,17.14 34.92,22.22 36.83,24.13 48.26,24.13 49.53,25.4 S11.1 | ZU4.1 125.99,22.6 v125.73,22.86 | v120.02,26.67 115.57,26.67 113.03,24.13 89.53,24.13 88.27,25.4 88.27,34.93 S10.1 | v71.12,41.28 v67.31,41.28
  Bottom 0.406: S11.1 55.88,35.56 56.52,36.2 56.52,40.64 57.15,41.28 | S10.1 87,34.93 77.47,34.93 76.2,36.2 76.2,40.01 74.93,41.28 v71.12,41.28 | S12.1 55.88,54.61 57.15,53.34 57.15,41.28 | v125.73,22.86 123.83,22.86 v120.02,26.67 | v67.31,41.28 57.15,41.28
KP_R4  (via drill 0.7 pad 0.3)
  Top 0.406: S15.1 11.43,29.21 12.06,29.84 12.06,34.93 S14.1 11.43,48.9 12.06,49.53 12.06,53.98 S13.1 | v58.42,24.13 72.39,24.13 73.03,23.5 115.57,23.5 117.47,25.4 121.28,25.4 121.92,24.77 125.09,24.77 125.73,25.4 125.73,33.02 126.36,33.66 129.54,33.66 130.18,33.02 130.18,27.94 129.54,27.3 129.54,17.78 128.53,16.77 ZU4.32
  Bottom 0.406: S15.1 11.43,19.68 12.7,20.95 55.24,20.95 v58.42,24.13
LED1+  (via drill 0.6 pad 0.3)
  Top 0.406: ZU4.14 113.59,12.77 v113.03,13.33 | v130.18,38.1 130.18,59.05 131.02,59.9 LED1.A
  Bottom 0.406: v113.03,13.33 119.51,13.33 119.89,12.95 128.52,12.95 128.91,13.33 128.91,26.67 130.56,28.32 130.56,37.08 130.18,37.47 v130.18,38.1
LED1-
  Top 0.406: LED1.C 136.95,54.4 137.79,55.25 137.79,56.52 138.43,57.15 R2.1
LED2+  (via drill 0.6 pad 0.3)
  Top 0.406: ZU4.15 118.02,11.97 117.47,11.43 117.47,10.79 116.84,10.16 114.43,10.16 113.79,9.53 J1.MOSI | LED2.A 132.29,42.12 v131.44,41.28
  Bottom 0.406: v131.44,41.28 131.44,27.94 129.79,26.29 129.79,12.32 129.54,12.06 120.02,12.06 118.11,10.16 118.11,8.89 116.84,7.62 115.06,7.62 J1.MOSI
LED2-  (via drill 0.6 pad 0.3)
  Top 0.406: LED2.C v134.62,33.02 | v138.43,53.98 139.06,54.61 R3.1
  Bottom 0.406: v134.62,33.02 135.25,33.02 136.53,34.29 136.53,47.62 135.89,48.26 135.89,51.44 v138.43,53.98
LED3+  (via drill 0.6 pad 0.3)
  Top 0.406: LED3.A 131.66,26.25 v130.81,25.4 | ZU4.16 v118.9,8.26 118.9,7.14 118.11,6.35 J1.MISO
  Bottom 0.406: v130.81,25.4 130.81,11.43 130.18,10.79 123.83,10.79 121.28,8.26 v118.9,8.26
LED3-  (via drill 0.6, 0.6 pad 0.3)
  Top 0.406: LED3.C 134.83,20.95 134.83,17.99 v133.99,17.14 | v137.16,50.17 137.16,51.44 137.79,52.07 R4.1
  Bottom 0.406: v133.99,17.14 137.54,20.7 137.54,47.24 137.16,47.62 v137.16,50.17
LED4+  (via drill 0.6 pad 0.3)
  Top 0.406: ZU4.17 120.39,5.46 v119.38,4.45 115.7,4.45 115.06,5.08 115.06,7.62 J1.SCK | LED4.A 131.87,9.1 v131.44,9.53
  Bottom 0.406: v131.44,9.53 124.46,9.53 v119.38,4.45
LED4-  (via drill 0.6, 0.6 pad 0.3)
  Top 0.406: LED4.C 134.83,3.81 v137.16,3.81 | v138.43,48.26 138.43,48.9 139.06,49.53 R5.1
  Bottom 0.406: v137.16,3.81 135.25,5.71 135.25,17.14 138.43,20.32 v138.43,48.26
LED5+
  Top 0.406: ZU4.10 116.75,15.97 116.2,16.51 116.2,22.22 115.57,22.86 52.07,22.86 51.44,22.22 43.81,22.22 43.18,21.59 LED5.A
LED5-
  Top 0.406: LED5.C 38.95,11.22 38.73,11.43 R6.1
LED6+
  Top 0.406: ZU4.11 116.28,15.17 115.57,15.88 115.57,21.59 114.94,22.22 52.7,22.22 52.07,21.59 LED6.A
LED6-
  Top 0.406: LED6.C 47.84,11.22 47.62,11.43 R7.1
LED7+
  Top 0.406: ZU4.12 115.81,14.37 114.94,15.24 114.94,20.95 114.3,21.59 61.59,21.59 60.96,20.95 LED7.A
LED7-
  Top 0.406: LED7.C 56.73,11.22 56.52,11.43 R8.1
LED8+
  Top 0.406: ZU4.13 115.33,13.57 114.3,14.61 114.3,20.32 113.67,20.95 71.75,20.95 71.12,20.32 LED8.A
LED8-
  Top 0.406: LED8.C 66.25,11.22 66.04,11.43 R9.1
N$1
  pour Top (isolate 0.61): 4.45,62.87 0.64,59.05 0.64,4.45 4.45,0.64 150.5,0.64 154.31,4.45 154.31,59.05 150.5,62.87
N$20
  Top 0.406: R5.2 R4.2 R3.2 R2.2 142.88,57.15 144.12,58.4 T1.1
RD+
  Top 0.305: IC1.14 140.22,19.57 140.34,19.68 141.6,19.68 142.17,20.25 RN3.4
RD-
  Top 0.305: RN3.1 139.72,20.86 IC1.15
RESET  (via drill 0.7 pad 0.3)
  Top 0.305: IC1.31 142.22,12.17 141.86,11.81 136.91,11.81 134.35,14.37 ZU4.29
  Top 0.406: D4.A 82.12,59.36 R1.1 C3.1 81.92,56.52 81.57,56.17 RESET2.2 81.57,52.49 81.03,51.94 79.88,51.94 79.25,51.31 79.25,45.09 78.36,44.2 78.36,42.29 78.87,41.78 83.31,41.78 83.82,42.29 83.82,44.45 | ZU4.29 126.35,14.37 v125.98,14.73 | 83.82,44.45 97.79,44.45 100.97,47.62 106.68,47.62 107.31,48.26 107.31,49.53 107.95,50.17 110.49,50.17 111.12,49.53 111.12,27.94 v109.22,26.04 | 83.82,44.45 82.04,44.45 81.53,44.96 81.53,46.56 RESET2.1
  Bottom 0.406: J1.RESET 115.06,10.16 112.39,10.16 111.76,10.79 111.76,15.11 | v125.98,14.73 125.98,14.86 125.73,15.11 111.76,15.11 | 111.76,15.11 111.76,18.41 | 111.76,18.41 111.76,23.5 v109.22,26.04 | TP6.TP 111.76,18.41
RX  (via drill 0.6)
  Top 0.305: IC1.2 144.25,14.62 144.65,14.22 144.65,11.94 144.02,11.3 138.68,11.3 v137.92,10.54 | ZU4.31 135.29,15.97 v137.67,13.59
  Bottom 0.305: v137.92,10.54 137.92,13.33 v137.67,13.59
SCL  (via drill 0.7 pad 0.3)
  Top 0.305: ZU4.28 131.84,13.57 v132.08,13.33
  Bottom 0.406: v132.08,13.33 132.08,40.01 133.35,41.28 133.35,45.09 132.72,45.72 121.28,45.72 120.65,46.36 J3.2
SDA  (via drill 0.7 pad 0.3)
  Top 0.406: ZU4.27 130.74,12.77 131.44,12.06 v133.35,12.06
  Bottom 0.406: v133.35,12.06 133.35,14.61 132.72,15.24 132.72,39.37 133.99,40.64 133.99,45.72 133.35,46.36 123.83,46.36 123.19,46.99 J3.3
TX
  Top 0.305: ZU4.30 134.69,15.17 137.16,12.7 141.48,12.7 141.72,12.94 IC1.30
USHIELD  (1 unrouted)
  Top 0.406: Z2.2 138.43,36.83 139.35,37.75 X2.P$2 | Z1.2 144.41,20.59 144.78,20.95 | 144.78,20.95 X2.P$1 | L1.2 145.25,20.49 144.78,20.95
XTAL1
  Top 0.305: ZQ1.3 121.85,20 121.19,19.34 ZU4.7
XTAL2
  Top 0.305: ZQ1.1 119.45,20.25 120.39,19.31 ZU4.8
XUSB
  Top 0.813: X2.1 140.07,34.03 140.97,34.93 146.69,34.93 147.32,35.56 147.32,40.01 146.69,40.64 141.01,40.64 F1.2

### Text on the board
Top: REV001 | BS
Bottom: LS
tPlace: OctoRemote Controller | pkElectronics 2017 | OpenSource / Hardware